# Altium schematic sheet new_base_sensor (1).SchDoc
size A; SheetNumber: 1; SheetTotal: 1
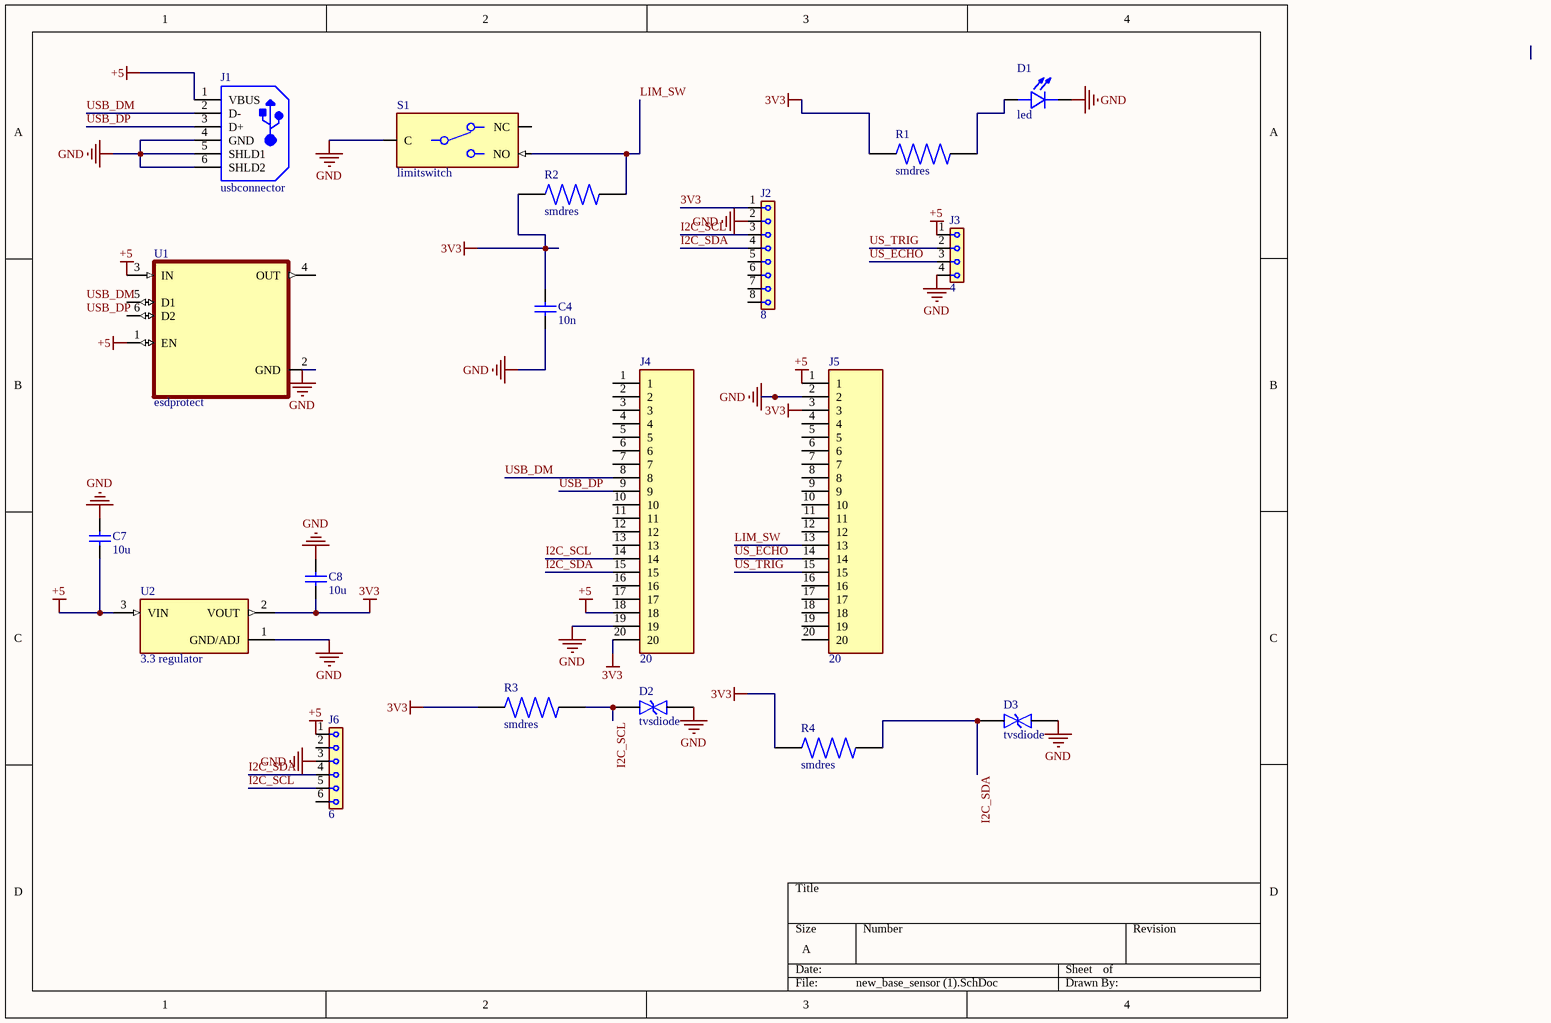
[diagram p0: new_base_sensor (1).SchDoc]

## Parts
C4  value 10n  (hidden comment: Capacitor)
C7  value 10u  (hidden comment: Capacitor)
C8  value 10u  (hidden comment: Capacitor)
D1  led  [led]
D2  tvsdiode  [tvsdiode]
D3  tvsdiode  [tvsdiode]
J1  usbconnector  [usbconnector]
J2  8  [8]
J3  4  [4]
J4  20  [20]
J5  20  [20]
J6  6  [6]
R1  smdres  [smdres]
R2  smdres  [smdres]
R3  smdres  [smdres]
R4  smdres  [smdres]
S1  limitswitch  [limitswitch]
U1  esdprotect  [esdprotect]
U2  3.3 regulator  [3.3regultor]

## Nets
3V3: C4.1 C8.1 J2.1 J4.20 J5.3 R1.1 R2.1 R3.1 R4.1 U2.2(VOUT)
+5: C7.1 J1.1(VBUS) J3.1 J4.18 J5.1 J6.1 U1.1(EN) U1.3(IN) U2.3(VIN)
GND: C4.2 C7.2 C8.2 D1.C D2.2 D3.2 J1.4(GND) J1.5(SHLD1) J1.6(SHLD2) J2.2 J3.4 J4.19 J5.2 J6.3 S1.C U1.2(GND) U2.1(GND/ADJ)
I2C_SCL: D2.1 J2.3 J4.14 J6.5 R3.0
I2C_SDA: D3.1 J2.4 J4.15 J6.4 R4.0
LIM_SW: J5.13 R2.0 S1.NO
US_ECHO: J3.3 J5.14
US_TRIG: J3.2 J5.15
USB_DM: J1.2(D-) J4.8
USB_DP: J1.3(D+) J4.9
NetD1_A: D1.A R1.0

Not connected (* = marked no-connect by the designer): J2 5 6 7 8; J4 1 2 3 4 5 6 7 10 11 12 13 16 17; J5 4 5 6 7 8 9 10 11 12 16 17 18 19 20; J6 2 6; S1 NC; U1 4(OUT) 5(D1) 6(D2)

## Notes on the sheet
- Labels drawn without touching a wire or pin: USB_DM, USB_DP

## Library data of the parts
C4 C7 C8 = Capacitor: SimulationGenericComponent: True
D1 = led: Green 1.6 x 0.8 x 0.75 mm (0603) 120 Âº 180 mcd Water Clear SMT LED; MF: Kingbright; MP: APT1608VGC/A; SnapEDA_Link: https://www.snapeda.com/parts/APT1608VGC/A/Kingbright/view-part/?ref=snap; Package: Package; Value: *; Check_prices: https://www.snapeda.com/parts/APT1608VGC/A/Kingbright/view-part/?ref=eda
D2 D3 = tvsdiode: 59V Clamp 169A (8/20Âµs) Ipp Tvs Diode Through Hole DO-201; MF: STMicroelectronics; MP: 1.5KE33CA; SnapEDA_Link: https://www.snapeda.com/parts/1.5KE33CA/STMicroelectronics/view-part/?ref=snap; Package: DO-201 Littelfuse; Value: *; Check_prices: https://www.snapeda.com/parts/1.5KE33CA/STMicroelectronics/view-part/?ref=eda
J1 = CMP-1752-00001-1: Single USB 2.0, Receptacle Connecter, B Type, 4 Position Through Hole, -55 to 85 degC, RoHS, Tray; DatasheetVersion: Oct-15; PackageDescription: USB Connecter, 4 Position Through Hole, Length 12.04 mm, Height 16.25 mm, Tail Length 3.1 mm; PackageReference: M701-330442; ComponentLink1Description: Datasheet; ComponentLink1URL: https://cdn.harwin.com/pdfs/M701-330442.pdf
J2 = 8: Female header Temperature range: -40 ... +125 Â°C Colour: Black Connector Design: Single Row / Straight Connector Termination: THT Contact material: Gold-Plated Copper Gender of contacts: Female Housing Material: Polybutylene Terephthalate (PBT) Pitch: 2; MF: WÃ¼rth Elektronik; MP: 62001011821; SnapEDA_Link: https://www.snapeda.com/parts/62001011821/W%25C3%25BCrth+Elektronik+Midcom/view-part/?ref=snap; Package: None; Value: *; Check_prices: https://www.snapeda.com/parts/62001011821/W%25C3%25BCrth+Elektronik+Midcom/view-part/?ref=eda
J3 = 4: Female header Temperature range: -40 ... +125 Â°C Colour: Black Connector Design: Single Row / Straight Connector Termination: THT Contact material: Gold-Plated Copper Gender of contacts: Female Housing Material: Polybutylene Terephthalate (PBT) Pitch: 2; MF: WÃ¼rth Elektronik; MP: 62001011821; SnapEDA_Link: https://www.snapeda.com/parts/62001011821/W%25C3%25BCrth+Elektronik+Midcom/view-part/?ref=snap; Package: None; Value: *; Check_prices: https://www.snapeda.com/parts/62001011821/W%25C3%25BCrth+Elektronik+Midcom/view-part/?ref=eda
J4 J5 = 20: AMPMODU 20 Position Through-Hole Single Row Straight .100 Inch Header; Product_Type: Connector; MF: TE Connectivity; MP: 2-87224-0; Centerline_Pitch: 2.54 mm[.1 in]; SnapEDA_Link: https://www.snapeda.com/parts/2-87224-0/TE+Connectivity+AMP+Connectors/view-part/?ref=snap; Package: None; Value: *; Number_of_Positions: 20; EU_RoHS_Compliance: Compliant; Check_prices: https://www.snapeda.com/parts/2-87224-0/TE+Connectivity+AMP+Connectors/view-part/?ref=eda
J6 = 6: Female header Temperature range: -40 ... +125 Â°C Colour: Black Connector Design: Single Row / Straight Connector Termination: THT Contact material: Gold-Plated Copper Gender of contacts: Female Housing Material: Polybutylene Terephthalate (PBT) Pitch: 2; MF: WÃ¼rth Elektronik; MP: 62001011821; SnapEDA_Link: https://www.snapeda.com/parts/62001011821/W%25C3%25BCrth+Elektronik+Midcom/view-part/?ref=snap; Package: None; Value: *; Check_prices: https://www.snapeda.com/parts/62001011821/W%25C3%25BCrth+Elektronik+Midcom/view-part/?ref=eda
R1-R4 = smdres: RES SMD 470 OHM 1% 1/10W 0603; MF: Panasonic; MP: ERJS03F4700V; SnapEDA_Link: https://www.snapeda.com/parts/ERJS03F4700V/Panasonic/view-part/?ref=snap; Package: 1608-2 Panasonic; Value: *; Check_prices: https://www.snapeda.com/parts/ERJS03F4700V/Panasonic/view-part/?ref=eda
S1 = limitswitch: Switch Snap Action N.O./N.C. SPDT Long Hinge Lever Solder 5A 250VAC 0.39N Screw Mount; MF: Omron; MP: SS-5GL111; SnapEDA_Link: https://www.snapeda.com/parts/SS-5GL111/Omron/view-part/?ref=snap; Package: None; Value: *; Check_prices: https://www.snapeda.com/parts/SS-5GL111/Omron/view-part/?ref=eda
U1 = esdprotect: Current-limit switch and D+/Dâ€“ ESD protection for USB Host; MF: Texas Instruments; MP: TPD3S044DBVR; SnapEDA_Link: https://www.snapeda.com/parts/TPD3S044DBVR/Texas+Instruments/view-part/?ref=snap; Package: SOT-23-6 Texas Instruments; Value: *; Check_prices: https://www.snapeda.com/parts/TPD3S044DBVR/Texas+Instruments/view-part/?ref=eda
U2 = 3.3 regulator: LDO Voltage Regulators 800MA LDO LINEAR REG; MF: ams AG; MP: AMS1117-3.3; SnapEDA_Link: https://www.snapeda.com/parts/AMS1117-3.3/ams/view-part/?ref=snap; Package: SOT-223 Seeed Technology; Value: *; Check_prices: https://www.snapeda.com/parts/AMS1117-3.3/ams/view-part/?ref=eda